# Altium schematic sheet controller.SchDoc
size A4; SheetNumber: 2; SheetTotal: 6
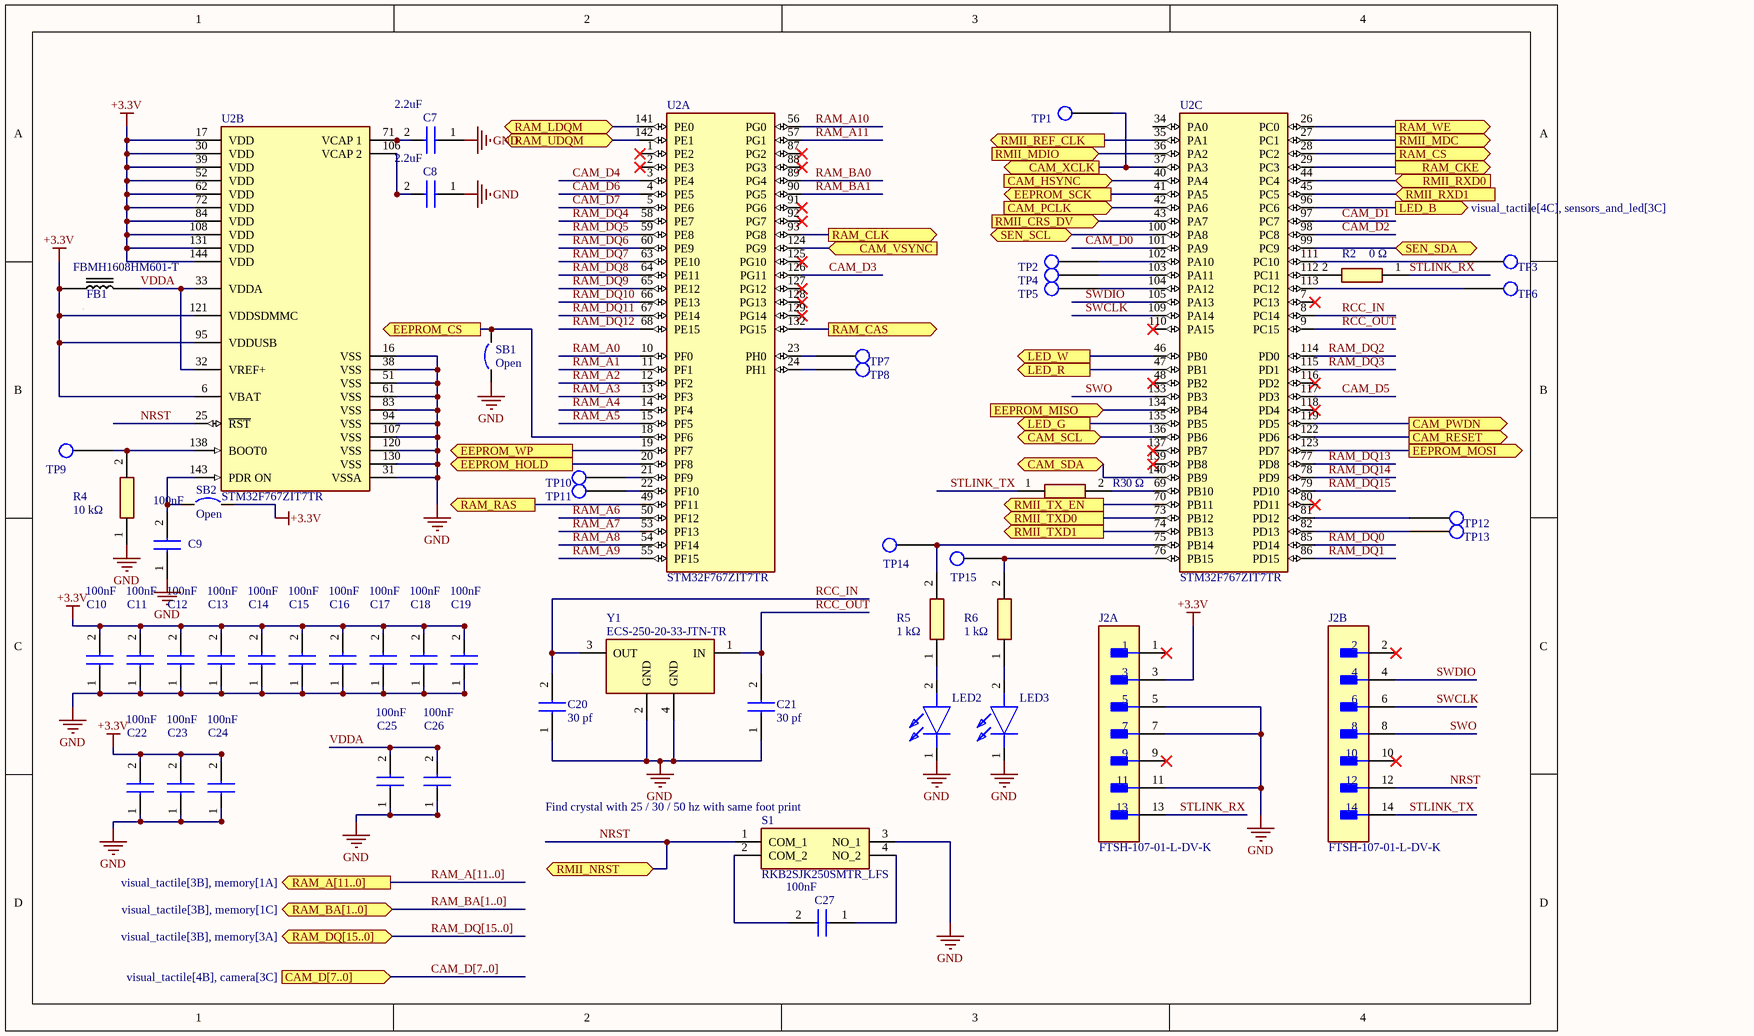
[diagram p0: controller.SchDoc]

## Parts
C7  value 2.2uF  [CAPC1608X87N]  (hidden comment: 06036C225KAT2A)
C8  value 2.2uF  [CAPC1608X87N]  (hidden comment: 06036C225KAT2A)
C9  value 100nF  [CAPC1608X87N]  (hidden comment: CGA3E2X7R1H104K080AA)
C10  value 100nF  [CAPC1608X87N]  (hidden comment: CGA3E2X7R1H104K080AA)
C11  value 100nF  [CAPC1608X87N]  (hidden comment: CGA3E2X7R1H104K080AA)
C12  value 100nF  [CAPC1608X87N]  (hidden comment: CGA3E2X7R1H104K080AA)
C13  value 100nF  [CAPC1608X87N]  (hidden comment: CGA3E2X7R1H104K080AA)
C14  value 100nF  [CAPC1608X87N]  (hidden comment: CGA3E2X7R1H104K080AA)
C15  value 100nF  [CAPC1608X87N]  (hidden comment: CGA3E2X7R1H104K080AA)
C16  value 100nF  [CAPC1608X87N]  (hidden comment: CGA3E2X7R1H104K080AA)
C17  value 100nF  [CAPC1608X87N]  (hidden comment: CGA3E2X7R1H104K080AA)
C18  value 100nF  [CAPC1608X87N]  (hidden comment: CGA3E2X7R1H104K080AA)
C19  value 100nF  [CAPC1608X87N]  (hidden comment: CGA3E2X7R1H104K080AA)
C20  30 pf  [CAPC1608X87N]
C21  30 pf  [CAPC1608X87N]
C22  value 100nF  [CAPC1608X87N]  (hidden comment: CGA3E2X7R1H104K080AA)
C23  value 100nF  [CAPC1608X87N]  (hidden comment: CGA3E2X7R1H104K080AA)
C24  value 100nF  [CAPC1608X87N]  (hidden comment: CGA3E2X7R1H104K080AA)
C25  value 100nF  [CAPC1608X87N]  (hidden comment: CGA3E2X7R1H104K080AA)
C26  value 100nF  [CAPC1608X87N]  (hidden comment: CGA3E2X7R1H104K080AA)
C27  value 100nF  [CAPC1608X87N]  (hidden comment: CGA3E2X7R1H104K080AA)
FB1  FBMH1608HM601-T  [BEADC1608X90N]
J2  FTSH-107-01-L-DV-K  [FP-FTSH-107-01-L-DV-K-MFG]  (parts A,B of 2)
LED2  150060RS75000  [LEDC1608X80N]  (value not drawn)
LED3  150060RS75000  [LEDC1608X80N]  (value not drawn)
R2  0 Ω  [RESC1005X35N]
R3  0 Ω  [RESC1005X35N]
R4  10 kΩ  [RESC1005X35N]
R5  1 kΩ  [RESC1005X35N]
R6  1 kΩ  [RESC1005X35N]
S1  RKB2SJK250SMTR_LFS  [RKB2SJK250SMTRLFS]
SB1  Open  [SB_0603]
SB2  Open  [SB_0603]
TP1  Test point  [test point]  (value not drawn)
TP2  Test point  [test point]  (value not drawn)
TP3  Test point  [test point]  (value not drawn)
TP4  Test point  [test point]  (value not drawn)
TP5  Test point  [test point]  (value not drawn)
TP6  Test point  [test point]  (value not drawn)
TP7  Test point  [test point]  (value not drawn)
TP8  Test point  [test point]  (value not drawn)
TP9  Test point  [test point]  (value not drawn)
TP10  Test point  [test point]  (value not drawn)
TP11  Test point  [test point]  (value not drawn)
TP12  Test point  [test point]  (value not drawn)
TP13  Test point  [test point]  (value not drawn)
TP14  Test point  [test point]  (value not drawn)
TP15  Test point  [test point]  (value not drawn)
U2  STM32F767ZIT7TR  [FP-LQFP144-1A-MFG]  (parts A,B,C of 3)
Y1  ECS-250-20-33-JTN-TR  [ECS-250-20-33-JTN-TR]

## Ports
CAM_D[7..0] (in, see visual_tactile[4B], camera[3C]), CAM_HSYNC (in, see visual_tactile[4B], camera[3B]), CAM_PCLK (in, see visual_tactile[4B], camera[3B]), CAM_PWDN (out, see visual_tactile[4B], camera[1C]), CAM_RESET (out, see visual_tactile[4B], camera[1C]), CAM_SCL (bidir, see visual_tactile[4B], camera[1C]), CAM_SDA (bidir, see visual_tactile[4B], camera[1C]), CAM_VSYNC (in, see visual_tactile[4B], camera[3B]), CAM_XCLK (out, see visual_tactile[4B], camera[1C]), EEPROM_CS (out, see visual_tactile[3B], memory[1D]), EEPROM_HOLD (out, see visual_tactile[3C], memory[1D]), EEPROM_MISO (in, see visual_tactile[3C], memory[3D]), EEPROM_MOSI (out, see visual_tactile[3C], memory[1D]), EEPROM_SCK (out, see visual_tactile[3C], memory[1D]), EEPROM_WP (out, see visual_tactile[3C], memory[1D]), LED_B (out, see visual_tactile[4C], sensors_and_led[3C]), LED_G (out, see visual_tactile[4C], sensors_and_led[2C]), LED_R (out, see visual_tactile[4C], sensors_and_led[2C]), LED_W (out, see visual_tactile[4C], sensors_and_led[1C]), RAM_A[11..0] (out, see visual_tactile[3B], memory[1A]), RAM_BA[1..0] (bidir, see visual_tactile[3B], memory[1C]), RAM_CAS (out, see visual_tactile[3B], memory[2C]), RAM_CKE (out, see visual_tactile[3B], memory[2B]), RAM_CLK (out, see visual_tactile[3B], memory[2B]), RAM_CS (out, see visual_tactile[3B], memory[2B]), RAM_DQ[15..0] (bidir, see visual_tactile[3B], memory[3A]), RAM_LDQM (bidir, see visual_tactile[3B], memory[3C]), RAM_RAS (out, see visual_tactile[3B], memory[2B]), RAM_UDQM (bidir, see visual_tactile[3B], memory[3C]), RAM_WE (out, see visual_tactile[3B], memory[2C]), RMII_CRS_DV (in, see visual_tactile[3D], ethernet[1B]), RMII_MDC (out, see visual_tactile[3D], ethernet[1B]), RMII_MDIO (in, see visual_tactile[3D], ethernet[1B]), RMII_NRST (bidir, see visual_tactile[3D], ethernet[1B]), RMII_REF_CLK (out, see visual_tactile[3D], ethernet[1B]), RMII_RXD0 (in, see visual_tactile[3C], ethernet[1B]), RMII_RXD1 (in, see visual_tactile[3C], ethernet[1B]), RMII_TX_EN (out, see visual_tactile[3C], ethernet[1B]), RMII_TXD0 (out, see visual_tactile[3C], ethernet[1B]), RMII_TXD1 (out, see visual_tactile[3C], ethernet[1B]), SEN_SCL (bidir, see visual_tactile[4B], sensors_and_led[1A]), SEN_SDA (bidir, see visual_tactile[4B], sensors_and_led[1B])

## Nets
+3.3V: C10.2 C11.2 C12.2 C13.2 C14.2 C15.2 C16.2 C17.2 C18.2 C19.2 C22.2 C23.2 C24.2 FB1.1 J2.3 SB2.2 U2.6(VBAT) U2.17(VDD) U2.30(VDD) U2.39(VDD) U2.52(VDD) U2.62(VDD) U2.72(VDD) U2.84(VDD) U2.95(VDDUSB) U2.108(VDD) U2.121(VDDSDMMC) U2.131(VDD) U2.144(VDD)
GND: C7.1 C8.1 C9.1 C10.1 C11.1 C12.1 C13.1 C14.1 C15.1 C16.1 C17.1 C18.1 C19.1 C20.1 C21.1 C22.1 C23.1 C24.1 C25.1 C26.1 J2.5 J2.7 J2.11 LED2.1(K) LED3.1(K) R4.1 S1.3(NO_1) SB1.1 U2.16(VSS) U2.31(VSSA) U2.38(VSS) U2.51(VSS) U2.61(VSS) U2.83(VSS) U2.94(VSS) U2.107(VSS) U2.120(VSS) U2.130(VSS) Y1.2(GND) Y1.4(GND)
CAM_D0: U2.101(PA9)
CAM_D1: U2.97(PC7)
CAM_D2: U2.98(PC8)
CAM_D3: U2.126(PG11)
CAM_D4: U2.3(PE4)
CAM_D5: U2.117(PD3)
CAM_D6: U2.4(PE5)
CAM_D7: U2.5(PE6)
CAM_HSYNC: U2.40(PA4) ; port CAM_HSYNC
CAM_PCLK: U2.42(PA6) ; port CAM_PCLK
CAM_PWDN: U2.119(PD5) ; port CAM_PWDN
CAM_RESET: U2.122(PD6) ; port CAM_RESET
CAM_SCL: U2.136(PB6) ; port CAM_SCL
CAM_SDA: U2.140(PB9) ; port CAM_SDA
CAM_VSYNC: U2.124(PG9) ; port CAM_VSYNC
CAM_XCLK: TP1.1 U2.37(PA3) ; port CAM_XCLK
EEPROM_CS: SB1.2 U2.18(PF6) ; port EEPROM_CS
EEPROM_HOLD: U2.20(PF8) ; port EEPROM_HOLD
EEPROM_MISO: U2.134(PB4) ; port EEPROM_MISO
EEPROM_MOSI: U2.123(PD7) ; port EEPROM_MOSI
EEPROM_SCK: U2.41(PA5) ; port EEPROM_SCK
EEPROM_WP: U2.19(PF7) ; port EEPROM_WP
LED_B: U2.96(PC6) ; port LED_B
LED_G: U2.135(PB5) ; port LED_G
LED_R: U2.47(PB1) ; port LED_R
LED_W: U2.46(PB0) ; port LED_W
NRST: J2.12 S1.1(COM_1) U2.25(~{RST}) ; port RMII_NRST
RAM_A0: U2.10(PF0)
RAM_A1: U2.11(PF1)
RAM_A2: U2.12(PF2)
RAM_A3: U2.13(PF3)
RAM_A4: U2.14(PF4)
RAM_A5: U2.15(PF5)
RAM_A6: U2.50(PF12)
RAM_A7: U2.53(PF13)
RAM_A8: U2.54(PF14)
RAM_A9: U2.55(PF15)
RAM_A10: U2.56(PG0)
RAM_A11: U2.57(PG1)
RAM_BA0: U2.89(PG4)
RAM_BA1: U2.90(PG5)
RAM_CAS: U2.132(PG15) ; port RAM_CAS
RAM_CKE: U2.29(PC3) ; port RAM_CKE
RAM_CLK: U2.93(PG8) ; port RAM_CLK
RAM_CS: U2.28(PC2) ; port RAM_CS
RAM_DQ0: U2.85(PD14)
RAM_DQ1: U2.86(PD15)
RAM_DQ2: U2.114(PD0)
RAM_DQ3: U2.115(PD1)
RAM_DQ4: U2.58(PE7)
RAM_DQ5: U2.59(PE8)
RAM_DQ6: U2.60(PE9)
RAM_DQ7: U2.63(PE10)
RAM_DQ8: U2.64(PE11)
RAM_DQ9: U2.65(PE12)
RAM_DQ10: U2.66(PE13)
RAM_DQ11: U2.67(PE14)
RAM_DQ12: U2.68(PE15)
RAM_DQ13: U2.77(PD8)
RAM_DQ14: U2.78(PD9)
RAM_DQ15: U2.79(PD10)
RAM_LDQM: U2.141(PE0) ; port RAM_LDQM
RAM_RAS: U2.49(PF11) ; port RAM_RAS
RAM_UDQM: U2.142(PE1) ; port RAM_UDQM
RAM_WE: U2.26(PC0) ; port RAM_WE
RCC_IN: C20.2 U2.8(PC14) Y1.3(OUT)
RCC_OUT: C21.2 U2.9(PC15) Y1.1(IN)
RMII_CRS_DV: U2.43(PA7) ; port RMII_CRS_DV
RMII_MDC: U2.27(PC1) ; port RMII_MDC
RMII_MDIO: U2.36(PA2) ; port RMII_MDIO
RMII_REF_CLK: U2.35(PA1) ; port RMII_REF_CLK
RMII_RXD0: U2.44(PC4) ; port RMII_RXD0
RMII_RXD1: U2.45(PC5) ; port RMII_RXD1
RMII_TX_EN: U2.70(PB11) ; port RMII_TX_EN
RMII_TXD0: U2.73(PB12) ; port RMII_TXD0
RMII_TXD1: U2.74(PB13) ; port RMII_TXD1
SEN_SCL: U2.100(PA8) ; port SEN_SCL
SEN_SDA: U2.99(PC9) ; port SEN_SDA
STLINK_RX: J2.13 R2.1
STLINK_TX: J2.14 R3.1
SWCLK: J2.6 U2.109(PA14)
SWDIO: J2.4 U2.105(PA13)
SWO: J2.8 U2.133(PB3)
VDDA: C25.2 C26.2 FB1.2 U2.32(VREF+) U2.33(VDDA)
NetC7_2: C7.2 U2.71(VCAP_1)
NetC8_2: C8.2 U2.106(VCAP_2)
NetC9_2: C9.2 SB2.1 U2.143(PDR_ON)
NetC27_1: C27.1 S1.4(NO_2)
NetC27_2: C27.2 S1.2(COM_2)
NetLED2_2: LED2.2(A) R5.1
NetLED3_2: LED3.2(A) R6.1
NetR2_2: R2.2 U2.112(PC11)
NetR3_2: R3.2 U2.69(PB10)
NetR4_2: R4.2 TP9.1 U2.138(BOOT0)
NetR5_2: R5.2 TP14.1 U2.75(PB14)
NetR6_2: R6.2 TP15.1 U2.76(PB15)
NetTP2_1: TP2.1 U2.102(PA10)
NetTP3_1: TP3.1 U2.111(PC10)
NetTP4_1: TP4.1 U2.103(PA11)
NetTP5_1: TP5.1 U2.104(PA12)
NetTP6_1: TP6.1 U2.113(PC12)
NetTP7_1: TP7.1 U2.23(PH0)
NetTP8_1: TP8.1 U2.24(PH1)
NetTP10_1: TP10.1 U2.21(PF9)
NetTP11_1: TP11.1 U2.22(PF10)
NetTP12_1: TP12.1 U2.81(PD12)
NetTP13_1: TP13.1 U2.82(PD13)

Not connected (* = marked no-connect by the designer): J2 1* 2* 9* 10*; U2 1(PE2)* 2(PE3)* 7(PC13)* 34(PA0) 48(PB2)* 80(PD11)* 87(PG2)* 88(PG3)* 91(PG6)* 92(PG7)* 110(PA15)* 116(PD2)* 118(PD4)* 125(PG10)* 127(PG12)* 128(PG13)* 129(PG14)* 137(PB7)* 139(PB8)*

## Buses and harness runs
bus CAM_D[7..0] = port CAM_D[7..0]
bus RAM_A[11..0] = port RAM_A[11..0]
bus RAM_BA[1..0] = port RAM_BA[1..0]
bus RAM_DQ[15..0] = port RAM_DQ[15..0]

## Notes on the sheet
- (near S1) Find crystal with 25 / 30 / 50 hz with same foot print

## Library data of the parts
C7 C8 = C0603C300J5GACTU: Ceramic Capacitor, Multilayer, Ceramic, 6.3V, 10% +Tol, 10% -Tol, X7R, 15% TC, 2.2uF, Surface Mount, 0603; Manufacturer_Name: KEMET; Manufacturer: Kyocera AVX; Multilayer: Yes; Datasheet Link: https://content.kemet.com/datasheets/KEM_C1003_C0G_SMD.pdf; Height: 0.87mm; Manufacturer_Part_Number: C0603C300J5GACTU; Mouser Part Number: 80-C0603C300J5G; Mouser Price/Stock: https://www.mouser.co.uk/ProductDetail/KEMET/C0603C300J5GACTU?qs=KQYYlyH3z3RpeXhtJmCcMA%3D%3D; Arrow Part Number: C0603C300J5GACTU; Arrow Price/Stock: https://www.arrow.com/en/products/c0603c300j5gactu/kemet-corporation; Supplier: Arrow Electronics; Supplier Part Number: 06036C225KAT2A; Manufacturer Part Number: 06036C225KAT2A; RoHS: Yes; Category: Ceramic Capacitors; Stock: 848000; Pricing: 4000=0.0297, 8000=0.0293 (USD); Mounting Technology: Surface Mount; Pins: 2; Dielectric Material: Ceramic; Package Shape: Rectangular; Case/Package: 0603; Terminal Finish: Nickel; Min Operating Temperature: -55°C; Max Operating Temperature: 125°C; Capacitor Type: Ceramic; Tolerance  (fill in as +-): 10%; Package Style: SMTMeter; Packaging: Tape and Reel; Tolerance (fill in as +-): 10%; Rated DC Voltage (URdc): 6.3V; Temperature Characteristics Code: X7R; Termination: Wraparound; JESD-609 Code: e3; Length: 1.6mm; Width: 0.81mm; Reach SVHC Compliant: Yes; RoHS Compliant: Yes; ComponentLink1URL: https://datasheet.ciiva.com:443/pdfs/VipMasterIC/IC/AVXC/AVXC-S-A0009640452/AVXC-S-A0009640452-1.pdf?src-supplier=IHS+Markit; ComponentLink1Description: https://datasheet.ciiva.com:443/pdfs/VipMasterIC/IC/AVXC/AVXC-S-A0009640452/AVXC-S-A0009640452-1.pdf?src-supplier=IHS+Markit
C9-C19 C22-C27 = C0603C300J5GACTU: Ceramic Capacitor, Multilayer, Ceramic, 50V, 10% +Tol, 10% -Tol, X7R, 15% TC, 0.1uF, Surface Mount, 0603; Manufacturer_Name: KEMET; Manufacturer: TDK; Multilayer: Yes; Reference Standard: AEC-Q200; Datasheet Link: https://content.kemet.com/datasheets/KEM_C1003_C0G_SMD.pdf; Height: 0.87mm; Manufacturer_Part_Number: C0603C300J5GACTU; Mouser Part Number: 80-C0603C300J5G; Mouser Price/Stock: https://www.mouser.co.uk/ProductDetail/KEMET/C0603C300J5GACTU?qs=KQYYlyH3z3RpeXhtJmCcMA%3D%3D; Arrow Part Number: C0603C300J5GACTU; Arrow Price/Stock: https://www.arrow.com/en/products/c0603c300j5gactu/kemet-corporation; Supplier: Rs; Supplier Part Number: 7882985P; Manufacturer Part Number: CGA3E2X7R1H104K080AA; RoHS: Yes; Category: Ceramic Capacitors; Stock: 84850; Pricing: 250=0.042, 500=0.039, 1000=0.037, 2500=0.033 (EUR); Mounting Technology: Surface Mount; Pins: 2; Dielectric Material: Ceramic; Package Shape: Rectangular; Case/Package: 0603; Terminal Finish: Nickel; Min Operating Temperature: -55°C; Max Operating Temperature: 125°C; JESD-609 Code: e3; Capacitor Type: Ceramic; Tolerance  (fill in as +-): 10%; Package Style: SMTMeter; Packaging: Tape and Reel; Tolerance (fill in as +-): 10%; Rated DC Voltage (URdc): 50V; Temperature Characteristics Code: X7R; Termination: Wraparound; Length: 1.6mm; Width: 0.8mm; Reach SVHC Compliant: Yes; RoHS Compliant: Yes; ComponentLink1URL: https://datasheet.ciiva.com:443/pdfs/VipMasterIC/IC/TDKC/TDKC-S-A0008953915/TDKC-S-A0008953915-1.pdf?src-supplier=IHS+Markit; ComponentLink1Description: https://datasheet.ciiva.com:443/pdfs/VipMasterIC/IC/TDKC/TDKC-S-A0008953915/TDKC-S-A0008953915-1.pdf?src-supplier=IHS+Markit
C20 C21 = C0603C300J5GACTU: Ceramic Capacitor, Multilayer, Ceramic, 50V, 5% +Tol, 5% -Tol, C0G, 30ppm/Cel TC, 0.00003uF, Surface Mount, 0603; Manufacturer_Name: KEMET; Value: 30pF; Multilayer: Yes; Datasheet Link: https://content.kemet.com/datasheets/KEM_C1003_C0G_SMD.pdf; Height: 0.87mm; Manufacturer_Part_Number: C0603C300J5GACTU; Mouser Part Number: 80-C0603C300J5G; Mouser Price/Stock: https://www.mouser.co.uk/ProductDetail/KEMET/C0603C300J5GACTU?qs=KQYYlyH3z3RpeXhtJmCcMA%3D%3D; Arrow Part Number: C0603C300J5GACTU; Arrow Price/Stock: https://www.arrow.com/en/products/c0603c300j5gactu/kemet-corporation; Supplier: Mouser; Supplier Part Number: 80-C0603C300J5G; Manufacturer: KEMET; Manufacturer Part Number: C0603C300J5GACTU; RoHS: Yes; Category: Ceramic Capacitors; Stock: 135157; Pricing: 1=0.1, 10=0.032, 50=0.032, 100=0.016, 1000=0.011, 10000=0.008 (USD); Mounting Technology: Surface Mount; Pins: 2; Dielectric Material: Ceramic; Package Shape: Rectangular; Case/Package: 0603; Terminal Finish: Nickel; Min Operating Temperature: -55°C; Max Operating Temperature: 125°C; JESD-609 Code: e3; Capacitor Type: Ceramic; Tolerance  (fill in as +-): 5%; Package Style: SMTMeter; Packaging: Tape and Reel; Tolerance (fill in as +-): 5%; Rated DC Voltage (URdc): 50V; Temperature Characteristics Code: C0G; Termination: Wraparound; Length: 1.6mm; Width: 0.8mm; Reach SVHC Compliant: Yes; RoHS Compliant: Yes; ComponentLink1URL: https://datasheet.ciiva.com:443/pdfs/VipMasterIC/IC/KEME/KEME-S-A0005605168/KEME-S-A0005605168-1.pdf?src-supplier=IHS+Markit; ComponentLink1Description: https://datasheet.ciiva.com:443/pdfs/VipMasterIC/IC/KEME/KEME-S-A0005605168/KEME-S-A0005605168-1.pdf?src-supplier=IHS+Markit; ComponentLink2URL: https://datasheet.ciiva.com/22700/1691965-22700853.pdf?src-supplier=Element14; ComponentLink2Description: https://datasheet.ciiva.com/22700/1691965-22700853.pdf?src-supplier=Element14; ComponentLink3URL: https://datasheet.ciiva.com/5420/kem-c1003-c0g-smd-356956-5420875.pdf?src-supplier=Mouser; ComponentLink3Description: https://datasheet.ciiva.com/5420/kem-c1003-c0g-smd-356956-5420875.pdf?src-supplier=Mouser
FB1 = FBMH1608HM601-T: Ferrite Bead; Manufacturer_Name: TAIYO YUDEN; Datasheet Link: https://componentsearchengine.com/Datasheets/2/FBMH1608HM601-T.pdf; Height: 0.9mm; Manufacturer_Part_Number: FBMH1608HM601-T; Mouser Part Number: 963-FBMH1608HM601-T; Mouser Price/Stock: https://www.mouser.co.uk/ProductDetail/Taiyo-Yuden/FBMH1608HM601-T?qs=I6KAKw0tg2y6O4cu0afp%252BA%3D%3D; Arrow Part Number: FBMH1608HM601-T; Arrow Price/Stock: https://www.arrow.com/en/products/fbmh1608hm601-t/taiyo-yuden
J2 = CMP-02766-001412-1: CONN HEADER SMD 14POS 1.27MM; Number of Contacts: 14; Gender: Male; Termination: Solder; Lead Free: Lead Free; Depth: 5.84mm; Min Operating Temperature: -55°C; Length: 8.89mm; RoHS Compliant: Yes; Housing Material: Polymer; Housing Color: Black; Max Operating Temperature: 125°C; Number of Rows: 2; Pitch: 1.27mm; Radiation Hardening: No; Orientation: Straight; Packaging: Rail/Tube; Contact Material: Bronze; Contact Plating: Gold
LED2 LED3 = 150060RS75000: LED; Manufacturer_Name: Wurth Elektronik; Datasheet Link: http://katalog.we-online.de/led/datasheet/150060RS75000.pdf; Height: 0.8mm; Manufacturer_Part_Number: 150060RS75000; Mouser Part Number: 710-150060RS75000; Mouser Price/Stock: https://www.mouser.co.uk/ProductDetail/Wurth-Elektronik/150060RS75000?qs=LlUlMxKIyB3QnmZ3fw%2FVCA%3D%3D
R2-R6 = CPF0402B100KE: Resistor; Manufacturer_Name: TE Connectivity; Datasheet Link: http://www.farnell.com/datasheets/1786775.pdf; Height: 0.35mm; Manufacturer_Part_Number: CPF0402B100KE; Mouser Part Number: 279-CPF0402B100KE; Mouser Price/Stock: https://www.mouser.co.uk/ProductDetail/TE-Connectivity-Holsworthy/CPF0402B100KE?qs=CXI0wBT1M2h4W2Gm72yIGA%3D%3D; Arrow Part Number: CPF0402B100KE; Arrow Price/Stock: https://www.arrow.com/en/products/cpf0402b100ke/te-connectivity?region=nac
S1 = RKB2SJK250SMTR_LFS: Switch; Manufacturer_Name: C & K COMPONENTS; Manufacturer_Part_Number: RKB2SJK250SMTR LFS; Datasheet Link: https://www.ckswitches.com/media/3130/ck_rk_datasheet.pdf; Height: 2.7mm; Mouser Part Number: 611-RKB2SJK250SMTRLF; Mouser Price/Stock: https://www.mouser.co.uk/ProductDetail/CK/RKB2SJK250SMTR-LFS?qs=iLbezkQI%252BsjlTHT7lSJp%2Fw%3D%3D; Arrow Part Number: RKB2SJK250SMTR LFS; Arrow Price/Stock: https://www.arrow.com/en/products/rkb2sjk250smtr-lfs/ck?region=europe
SB1 SB2 = Circuit Breaker: Published: 24-Mar-1999; Revision: July-2002: Re-released for DXP Platform.; Publisher: Altium Limited
U2 = CMP-12105-000028-1: ARM® Cortex®-M7 STM32F7 Microcontroller IC 32-Bit 216MHz 2MB (2M x 8) FLASH 144-LQFP (20x20); Manufacturer: STMicroelectronics; Standoff Height: 0.05mm; Number Of A/D Converters: 3; Ram Size: 512KBytes; Number Of Uart Channels: 8; Number Of Cores: 1; Max Junction Temp: +125°C; Number Of I/Os: 114; Core Architecture: ARM Cortex-M7; Number Of Spi Channels: 6; Interface: I2C,SPI,UART,USART,CAN,USB,LIN,IrDA,I2S,SMBus,Other; Max Supply Voltage: 3.6V; Number Of Adc Channels: 24; Memory Size: 2048KBytes; Min Supply Voltage: 1.65V; Number Of I2C Channels: 4; Number Of Timers/Counters: 15; Data Bus Width: 32bits; Temperature Range Low: -40°C; Category: IC; Memory Type: FLASH; Ambient Temperature Range Low: -40°C; RoHS: TRUE; ComponentLink2URL: https://www.st.com/resource/en/datasheet/stm32f767zi.pdf; Frequency: 216MHz; Temperature Range High: +125°C; Temperature: -40°C to +125°C; Manufacturer Part Number: STM32F767ZIT7TR; Package: LQFP144-1A; Number Of Usb Channels: 1; Device Class L1: Integrated Circuits (ICs); Octopart: https://octopart.com/stm32f767zit7tr-stmicroelectronics-104904785; Device Class L3: Microcontrollers; Ambient Temperature Range High: +105°C; ComponentLink2Description: Datasheet; Automotive: No; Lead Free: Yes; Device Class L2: Embedded Processors and Controllers; Height: 1.6mm
Y1 = ECS-250-20-33-JTN-TR: Crystal or Oscillator; Manufacturer_Name: RALTRON; Manufacturer_Part_Number: CO4605-100.000-T-TR; Datasheet Link: http://www.raltron.com//wp-content/uploads/2018/12/clock_co43_46_Series-updated.pdf; Height: 1.8mm